# EAGLE design AAA_third_source (EAGLE 7.2.0)
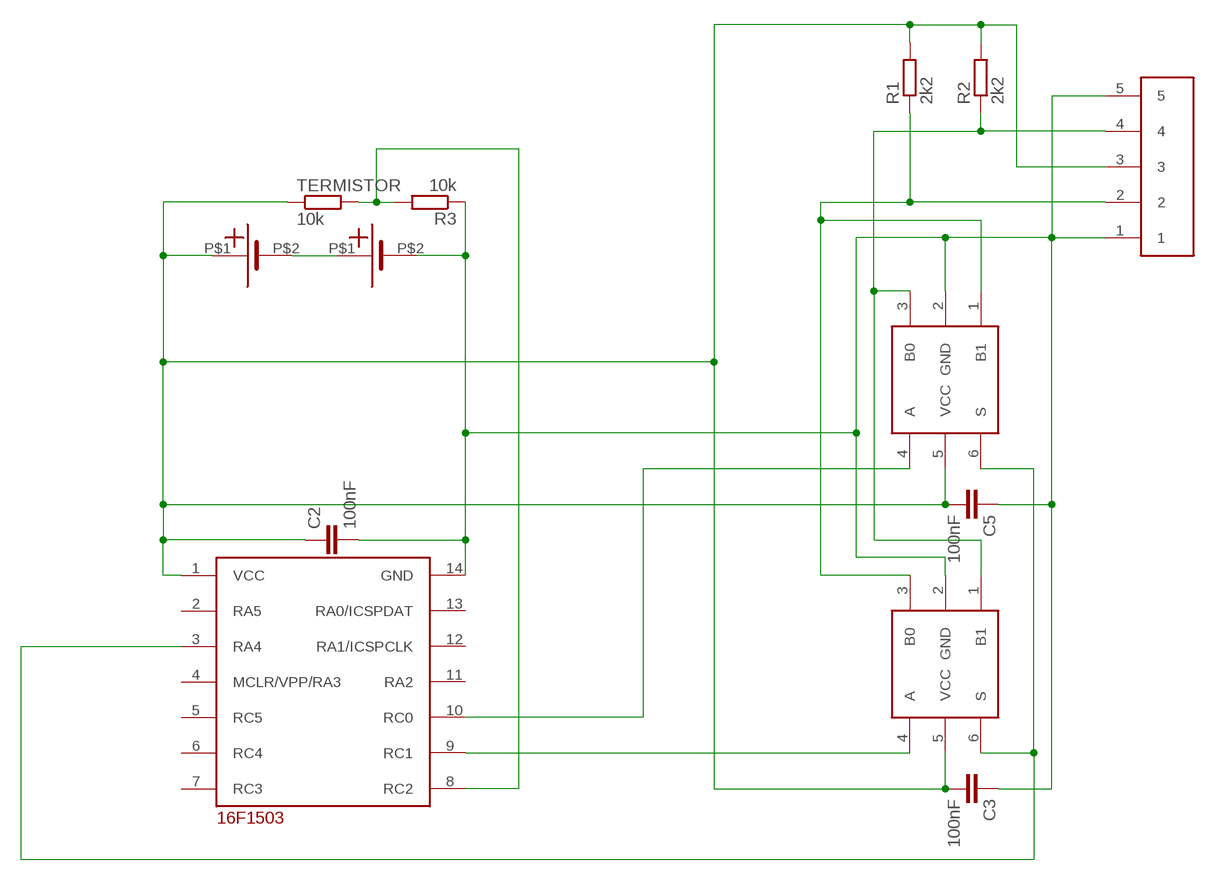
[diagram p0: schematic, sheet 1]

## Parts
C2  100nF  C-EUC0603  [C0603]
C3  100nF  C-EUC0603  [C0603]
C5  100nF  C-EUC0603  [C0603]
R1  2k2  R-EU_R0603  [R0603]
R2  2k2  R-EU_R0603  [R0603]
R3  10k  R-EU_R0603  [R0603]
TERMISTOR  10k  R-EU_R0603  [R0603]
U$1  16F103-TSSOP  [TSSOP14]
U$2  AAA_THIRD  [AAA_THIRD]
U$3  AAA_THIRD  [AAA_THIRD]
U$5  JUMPER5F-90  [JUMPER5F-90]
U$6  NC7SB3157P6X  [SC70-6L]
U$7  NC7SB3157P6X  [SC70-6L]

## Nets
GND: C2.2 C3.1 C5.1 R3.1 U$1.14(GND) U$3.P$2($2) U$5.1 U$5.5 U$6.2(GND) U$7.2(GND)
N$1: U$1.3(RA4) U$6.6(S) U$7.6(S)
N$2: U$2.P$2($2) U$3.P$1($1)
N$3: R3.2 TERMISTOR.2 U$1.8(RC2)
N$4: U$1.9(RC1) U$7.4(A)
N$6: R1.1 U$5.2 U$6.1(B1) U$7.3(B0)
N$7: U$1.10(RC0) U$6.4(A)
N$10: R2.1 U$5.4 U$6.3(B0) U$7.1(B1)
VCC: C2.1 C3.2 C5.2 R1.2 R2.2 TERMISTOR.1 U$1.1(VCC) U$2.P$1($1) U$5.3 U$6.5(VCC) U$7.5(VCC)
Unconnected: U$1.2(RA5) U$1.4(MCLR/VPP/RA3) U$1.5(RC5) U$1.6(RC4) U$1.7(RC3) U$1.11(RA2) U$1.12(RA1/ICSPCLK) U$1.13(RA0/ICSPDAT)

## Library data of the parts
C2 C3 C5 = resistor:C-EU: CAPACITOR, European symbol
R1-R3 TERMISTOR = resistor:R-EU_: RESISTOR, European symbol
U$1 = !stavebnice03:16F103-TSSOP
U$2 U$3 = !stavebnice03:AAA_THIRD
U$5 = !stavebnice03:JUMPER5F-90
U$6 U$7 = !stavebnice03:NC7SB3157P6X

## Board
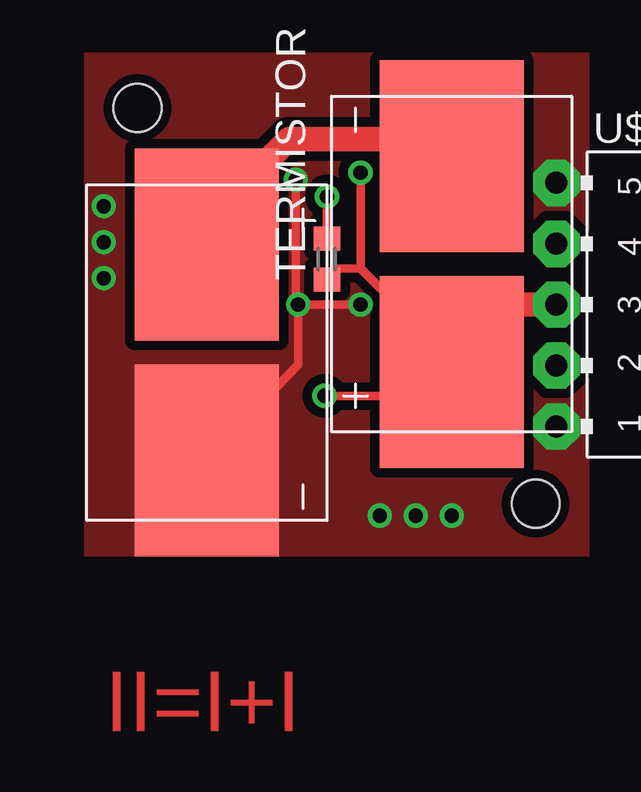
[diagram p1: board, top side]
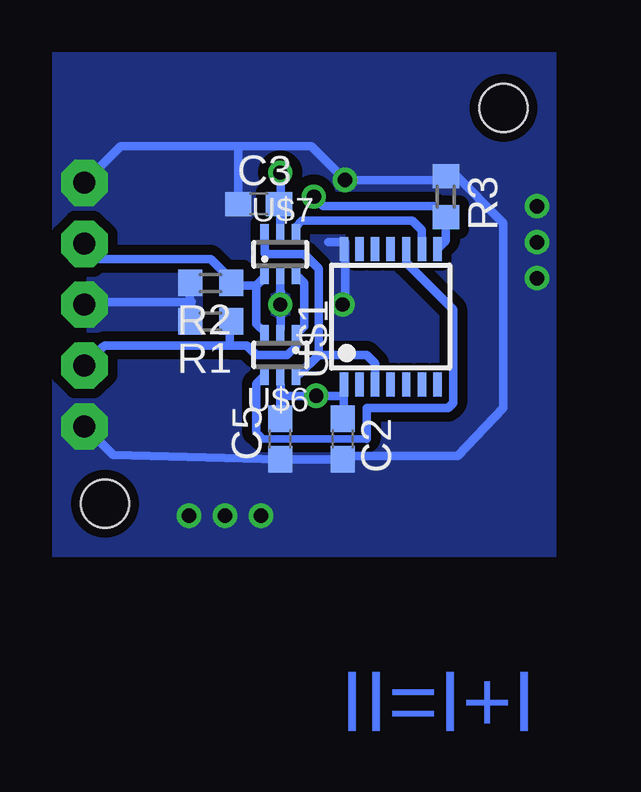
[diagram p2: board, bottom side, seen from below]

No outline drawn. Coordinates in mm, seen from the top.
Copper layers (1*16): Top 0.035mm / dielectric 1.5mm / Bottom 0.035mm
Design rules "default *": minimum track width 10mil, minimum drill 24mil, track to track 8mil, track to pad 8mil, pad to pad 8mil, via to via 8mil, smd to smd 8mil, copper to edge 0mil, drill to drill 8mil, minimum pad ring 10mil, minimum via ring 8mil, stop-mask expansion 4mil, vias tented up to drill 0mil, thermal gap 10mil
Holes 2 mm at 2.2,18.7 18.8,2.2

### Footprints (pad centres in the part's own frame; a part is rotated, then mirrored left to right if it is on the bottom)
C0603 = smd 1.1 x 1: 1 -0.85,0; 2 0.85,0
R0603 = smd 1 x 1.1: 1 -0.85,0; 2 0.85,0
TSSOP14 = smd 0.35 x 1: 1 -1.95,-2.825; 2 -1.3,-2.825; 3 -0.65,-2.825; 4 0,-2.825; 5 0.65,-2.825; 6 1.3,-2.825; 7 1.95,-2.825; 8 1.95,2.825; 9 1.3,2.825; 10 0.65,2.825; 11 0,2.825; 12 -0.65,2.825; 13 -1.3,2.825; 14 -1.95,2.825
AAA_THIRD = smd 8 x 6: P$1 -4.5,0; P$2 4.5,0
JUMPER5F-90 = drill 0.914 pad 1.93 octagon: 1 5.08,-2.54; 2 2.54,-2.54; 3 0,-2.54; 4 -2.54,-2.54; 5 -5.08,-2.54
SC70-6L = smd 0.35 x 0.8: 1 -0.65,-0.85; 2 0,-0.85; 3 0.65,-0.85; 4 0.65,0.85; 5 0,0.85; 6 -0.65,0.85

### Placement (x,y rotation side)
C2  8.9,4.9 270 bottom
C3  12.4,14.7 0 bottom
C5  11.5,4.9 90 bottom
R1  14.4,9.8 180 bottom
R2  14.4,11.4 180 bottom
R3  4.6,15 270 bottom
TERMISTOR  10.1,12.4 90 top
U$1  6.9,10 0 bottom
U$2  15.3,12.2 90 top
U$3  5.1,8.5 270 top
U$5  22.2,10.5 270 top
U$6  11.5,8.4 180 bottom
U$7  11.5,12.6 0 bottom

### Tracks (layer width: path | path; a pad name or v marks a point on that pad's centre or on a via)
GND  (via drill 0.6)
  Top 0.357: v11.5,10.5 v8.9,10.5 | U$3.P$2 8.9,8 v8.9,10.5 | v8.9,10.5 8.8,10.7 v8.8,15.7
  Bottom 0.356: 4.3,16 2.2,13.9 2.2,11.7 | R3.1 4.75,15.7 v8.8,15.7 10.2,17.1 11.1,17.1 | C3.1 13.25,17.05 13.2,17.1 | C2.2 C5.1
  Bottom 0.357: v11.5,10.5 11.49,9.61 U$7.2 11.49,10.51 v11.5,10.5 | U$6.2 11.49,9.59 v11.5,10.5 | 9.5,13.1 8.8,13.1 8.8,10.7 v8.9,10.5 | C2.2 8.87,4.2 4.1,4.2 2.2,6.2 2.2,11.7 | C5.1 18.47,4.23 U$5.1 | U$5.5 18.14,17.1 13.2,17.1 11.1,17.1
  other vias: 0.8,14.6 0.8,13.1 0.8,11.6 12.3,1.7 13.8,1.7 15.3,1.7
  pour Bottom (isolate 0.406, rank 2, no thermals): 0,0 0,21 21,21 21,0
  pour Top (isolate 0.406, no thermals): 0,0 0,21 21,21 21,0
N$1
  Bottom 0.356: U$1.3 7.55,8.05 7.9,8.4 | U$7.6 12.15,12.65 12.14,12.64
  Bottom 0.357: 12.14,12.64 12.1,12.6 10.5,12.6 9.9,12 9.9,8.4 | 7.9,8.4 9.9,8.4 | 9.9,8.4 10.7,7.6 10.79,7.6 U$6.6
N$2
  Top 0.356: 5,13.9 U$3.P$1
  Top 0.357: 15,17.4 U$2.P$2
  Top 1.016: 15,17.4 8.5,17.4 5,13.9
N$3  (via drill 0.6)
  Top 0.356: 10.1,13.3 TERMISTOR.2 v10.1,15
  Bottom 0.356: U$1.8 4.6,13.18 R3.2 4.65,14.15 5.1,14.6 9.7,14.6 v10.1,15
N$4
  Bottom 0.356: U$1.9 5.6,13.6 6,14
  Bottom 0.357: 6,14 10.6,14 10.84,13.76 U$7.4
N$6
  Bottom 0.356: 13.55,9.65 R1.1 13.6,9.75 13.6,8.8 | 13.6,8.8 18.82,8.8 18.87,8.75 | 13.6,8.8 12.9,8.8 12.5,8.4
  Bottom 0.357: U$7.3 10.5,11.4 10.5,9.6 U$6.1 10.84,8.76 11.2,8.4 12.5,8.4 12.52,8.4 | 18.87,8.75 U$5.2
N$7
  Bottom 0.305: 7.9,4.9 12.2,4.9 12.5,5.2
  Bottom 0.356: 12.5,5.2 12.5,7.2 U$6.4 | U$1.10 6.25,12.25 4.3,10.3
  Bottom 0.357: 4.3,10.3 4.3,6.4 4.5,6.2 7.9,6.2 7.9,4.9
N$10
  Bottom 0.356: 13.24,11.71 R2.1 | R2.1 13.58,11.58 14.4,12.4 19.02,12.4 U$5.4 | U$6.3 12.15,9.35 12.5,9.7 12.5,11.3 | U$7.1 12.15,11.65 12.5,11.3 | 12.5,11.3 13.45,11.3 R2.1
VCC  (via drill 0.6)
  Top 0.356: 11.5,12 10.55,12 TERMISTOR.1
  Top 0.357: v10,6.7 14.7,6.7 U$2.P$1 15.75,7.75 15.2,8.3 | v11.5,16 11.5,12 15.2,8.3 | 17.4,10.5 15.2,8.3
  Top 1.016: U$5.3 17.4,10.5
  Bottom 0.356: U$1.1 8.85,6.6 | 8.85,6.6 8.85,6 C2.1 | v10,6.7 8.95,6.7 8.85,6.6
  Bottom 0.357: 11.41,6.5 C5.2 11.5,6.7 | 15.26,10.56 15.2,10.5 | R2.2 15.28,10.52 15.2,10.5 | 15.2,10.5 15.26,10.44 R1.2 15.26,10.56 | 15.18,10.62 15.2,10.6 | 15.26,10.56 15.3,10.6 19.56,10.6 U$5.3 | 8.82,6.05 C2.1 8.82,6.21 | 11.5,6.7 11.49,6.91 U$6.5 11.49,6.81 11.5,6.8 11.5,6.7 | C3.2 11.49,14.63 U$7.5 11.49,15.91 v11.5,16 | 11.5,6.7 v10,6.7
  pour Bottom (isolate 0.406, no thermals): 19.4,12.4 19.4,8.8 14.9,8.8 14.9,12.3

### Text on the board
Top: II=I+I
Bottom: II=I+I
Dimension: AAA source